# EAGLE schematic Charger status detector (EAGLE 6.3)
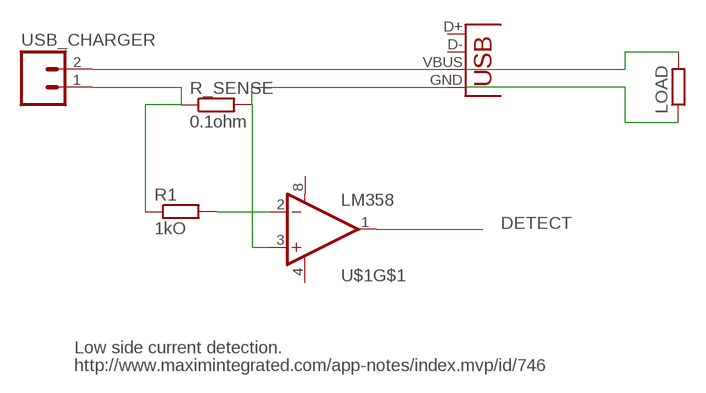
[diagram p0: schematic, sheet 1]

## Parts
JP1  USBOLD  [USB-MINIB-OLD]
LOAD  R-EU_0207/10  [0207/10]
R1  1kO  R-EU_0207/10  [0207/10]
R_SENSE  0.1ohm  R-EU_0207/10  [0207/10]
U$1  LM358  [DIP08]
USB_CHARGER  M02LOCK  [1X02_LOCK]

## Nets
DETECT: U$1.1(OUT)
N$1: JP1.VBUS USB_CHARGER.2
N$2: R1.1 R_SENSE.1 USB_CHARGER.1
N$3: JP1.GND R_SENSE.2 U$1.3(+IN)
N$4: R1.2 U$1.2(-IN)
N$5: LOAD.2
N$6: LOAD.1
Unconnected: JP1.D+ JP1.D- U$1.5(+IN) U$1.6(-IN) U$1.7(OUT)

## Notes on the sheet
- Low side current detection.
- http://www.maximintegrated.com/app-notes/index.mvp/id/746

## Power pins joined to a net without a drawn wire
V+: U$1.8(V+)
V-: U$1.4(V-)

## Library data of the parts
JP1 = SparkFun-Connectors:USB: USB Connectors USB-B-PTH is fully proven SKU : PRT-00139/CONN-08278 USB-miniB is fully proven SKU : PRT-00587 USB-A-PCB is untested. USB-A-H is throughly reviewed, but untested. Spark Fun Electronics SKU : PRT-00437 USB-B-SMT is throughly reviewed, but untested. Needs silkscreen touching up. USB-A-S has not been used/tested USB-MB-H has not been used/tested USB-MICROB has been used. CONN-09505
LOAD R1 R_SENSE = resistor:R-EU_: RESISTOR, European symbol
U$1 = SparkFun-AnalogIC:LM358: Jellybean op-amp
USB_CHARGER = SparkFun-Connectors:M02: Header 2 Standard 2-pin 0.1" header. Use with straight break away headers (SKU : PRT-00116), right angle break away headers (PRT-00553), swiss pins (PRT-00743), machine pins (PRT-00117), and female headers (PRT-00115). Molex polarized connector foot print use with SKU : PRT-08233 with associated crimp pins and housings.